# Altium project SX1255_HAT.PrjPcb
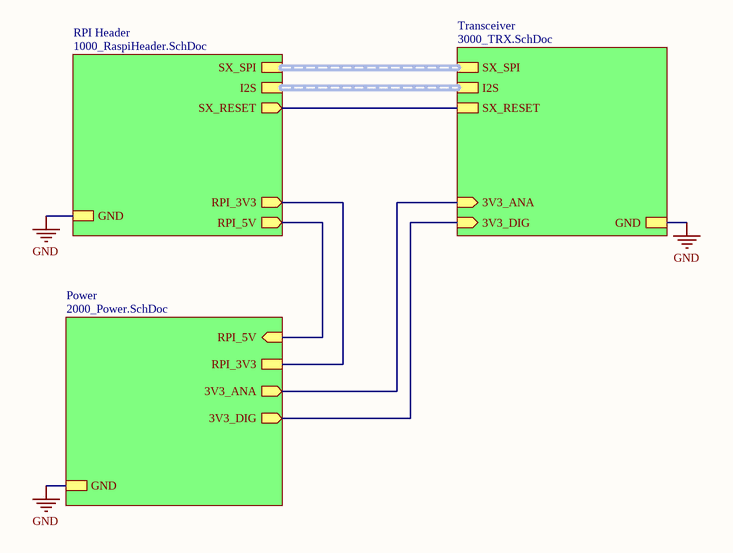
[diagram p0: TopSheet.SchDoc]
4 sheets, 7 parts. Net scope: hierarchical (ports join the sheet entries above them; power ports are global).
Board file: SX1255_HAT.PcbDoc
Sheets:
  TopSheet.SchDoc
    RPI Header = 1000_RaspiHeader.SchDoc
    Transceiver = 3000_TRX.SchDoc
    Power = 2000_Power.SchDoc

## Sheet TopSheet.SchDoc
size A4; SheetNumber: 1; SheetTotal: 4

### Sub-sheets
Power = 2000_Power.SchDoc: RPI_3V3, RPI_5V (in), 3V3_ANA (out), 3V3_DIG (out), GND
RPI Header = 1000_RaspiHeader.SchDoc: RPI_3V3 (out), RPI_5V (out), GND, SX_SPI, I2S, SX_RESET (out)
Transceiver = 3000_TRX.SchDoc: 3V3_ANA (in), 3V3_DIG (in), GND, SX_SPI, I2S, SX_RESET

### Nets
GND: sheet RPI Header/GND, sheet Transceiver/GND, sheet Power/GND
(unnamed): sheet RPI Header/RPI_3V3, sheet Power/RPI_3V3
(unnamed): sheet RPI Header/RPI_5V, sheet Power/RPI_5V
(unnamed): sheet RPI Header/SX_RESET, sheet Transceiver/SX_RESET
(unnamed): sheet Transceiver/3V3_ANA, sheet Power/3V3_ANA
(unnamed): sheet Transceiver/3V3_DIG, sheet Power/3V3_DIG

### Buses and harness runs
harness sheet RPI Header/I2S = sheet Transceiver/I2S
harness sheet RPI Header/SX_SPI = sheet Transceiver/SX_SPI

## Sheet 1000_RaspiHeader.SchDoc
size A3; SheetNumber: 2; SheetTotal: 4
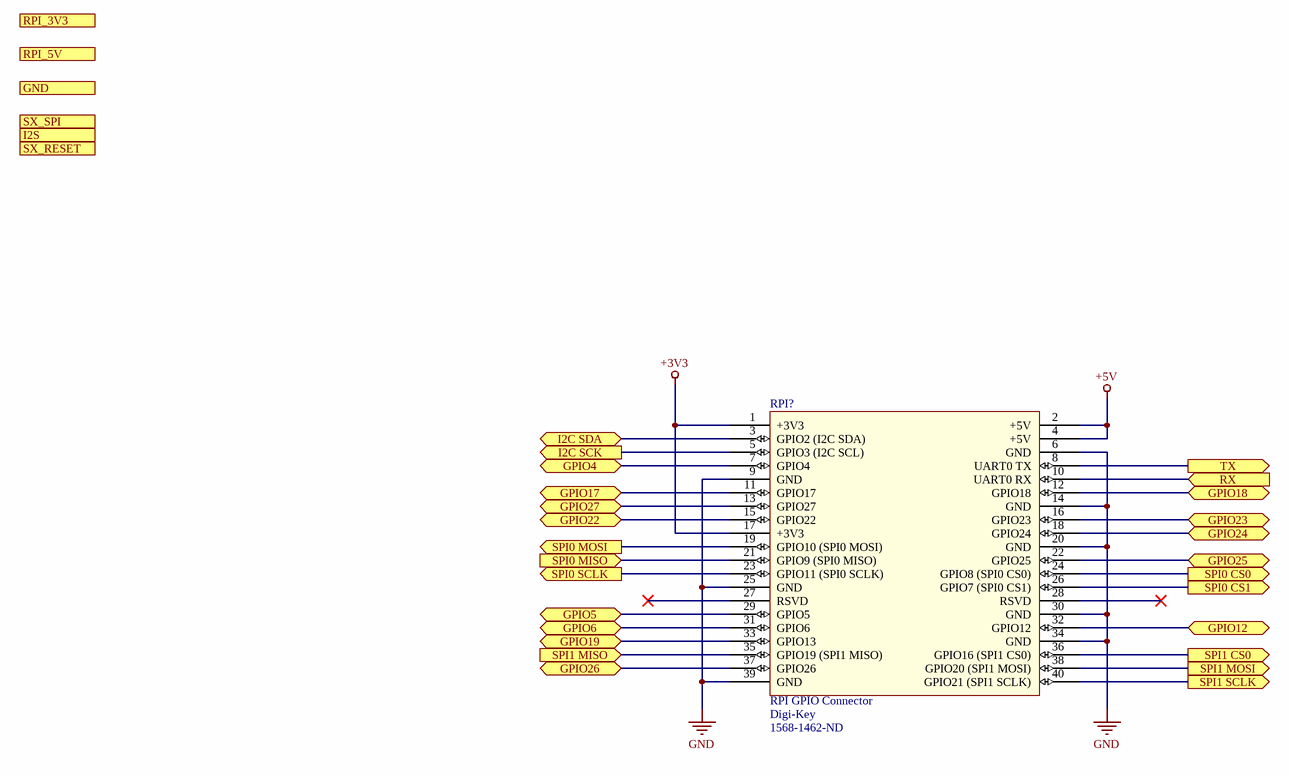
[diagram p1: 1000_RaspiHeader.SchDoc]

### Parts
RPI?  RPI GPIO Connector  Supplier 1: Digi-Key  Supplier Part Number 1: 1568-1462-ND  [rpi]

### Ports
GND, GPIO4 (bidir), GPIO5 (bidir), GPIO6 (bidir), GPIO12 (bidir), GPIO17 (bidir), GPIO18 (bidir), GPIO19 (bidir), GPIO22 (bidir), GPIO23 (bidir), GPIO24 (bidir), GPIO25 (bidir), GPIO26 (bidir), GPIO27 (bidir), I2C SCK (out), I2C SDA (bidir), I2S, RPI_3V3 (out), RPI_5V (out), RX (in), SPI0 CS0 (out), SPI0 CS1 (out), SPI0 MISO (in), SPI0 MOSI (out), SPI0 SCLK (out), SPI1 CS0 (out), SPI1 MISO (in), SPI1 MOSI (out), SPI1 SCLK (out), SX_RESET (out), SX_SPI, TX (out)

### Nets
+3V3: RPI?.1(+3V3) RPI?.17(+3V3)
+5V: RPI?.2(+5V) RPI?.4(+5V)
GND: RPI?.6(GND) RPI?.9(GND) RPI?.14(GND) RPI?.20(GND) RPI?.25(GND) RPI?.30(GND) RPI?.34(GND) RPI?.39(GND) ; port GND
NetRPI?_3: RPI?.3(GPIO2_(I2C_SDA)) ; port I2C SDA
NetRPI?_5: RPI?.5(GPIO3_(I2C_SCL)) ; port I2C SCK
NetRPI?_7: RPI?.7(GPIO4) ; port GPIO4
NetRPI?_8: RPI?.8(UART0_TX) ; port TX
NetRPI?_10: RPI?.10(UART0_RX) ; port RX
NetRPI?_11: RPI?.11(GPIO17) ; port GPIO17
NetRPI?_12: RPI?.12(GPIO18) ; port GPIO18
NetRPI?_13: RPI?.13(GPIO27) ; port GPIO27
NetRPI?_15: RPI?.15(GPIO22) ; port GPIO22
NetRPI?_16: RPI?.16(GPIO23) ; port GPIO23
NetRPI?_18: RPI?.18(GPIO24) ; port GPIO24
NetRPI?_19: RPI?.19(GPIO10_(SPI0_MOSI)) ; port SPI0 MOSI
NetRPI?_21: RPI?.21(GPIO9_(SPI0_MISO)) ; port SPI0 MISO
NetRPI?_22: RPI?.22(GPIO25) ; port GPIO25
NetRPI?_23: RPI?.23(GPIO11_(SPI0_SCLK)) ; port SPI0 SCLK
NetRPI?_24: RPI?.24(GPIO8_(SPI0_CS0)) ; port SPI0 CS0
NetRPI?_26: RPI?.26(GPIO7_(SPI0_CS1)) ; port SPI0 CS1
NetRPI?_29: RPI?.29(GPIO5) ; port GPIO5
NetRPI?_31: RPI?.31(GPIO6) ; port GPIO6
NetRPI?_32: RPI?.32(GPIO12) ; port GPIO12
NetRPI?_33: RPI?.33(GPIO13) ; port GPIO19
NetRPI?_35: RPI?.35(GPIO19_(SPI1_MISO)) ; port SPI1 MISO
NetRPI?_36: RPI?.36(GPIO16_(SPI1_CS0)) ; port SPI1 CS0
NetRPI?_37: RPI?.37(GPIO26) ; port GPIO26
NetRPI?_38: RPI?.38(GPIO20_(SPI1_MOSI)) ; port SPI1 MOSI
NetRPI?_40: RPI?.40(GPIO21_(SPI1_SCLK)) ; port SPI1 SCLK

Not connected (* = marked no-connect by the designer): RPI? 27(RSVD)* 28(RSVD)*

### Library data of the parts
RPI? = rpi connector: GPIO Header for Raspberry Pi A+/B+/Pi 2/Pi 3 - 2x20; Manufacturer: SparkFun Electronics; Manufacturer Part Number: PRT-14017; Nils Minor: author; nilsminor@web.de: mail; RoHS: RoHS Compliant; Category: Development Boards, Kits, Programmers; Stock 1: 150; Pricing 1: 1=1.84 (EUR); Part Status: Active; Accessory Type: Connector; For Use With/Related Products: Raspberry Pi; ComponentLink1URL: https://cdn.sparkfun.com/datasheets/Dev/RaspberryPi/12313.pdf; ComponentLink1Description: https://cdn.sparkfun.com/datasheets/Dev/RaspberryPi/12313.pdf

## Sheet 3000_TRX.SchDoc
size A3; SheetNumber: 4; SheetTotal: 4
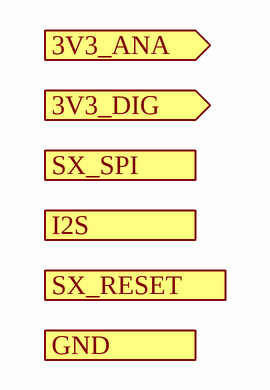
[diagram p2: 3000_TRX.SchDoc]

### Ports
3V3_ANA (in), 3V3_DIG (in), GND, I2S, SX_RESET, SX_SPI

## Sheet 2000_Power.SchDoc
size A3; SheetNumber: 3; SheetTotal: 4
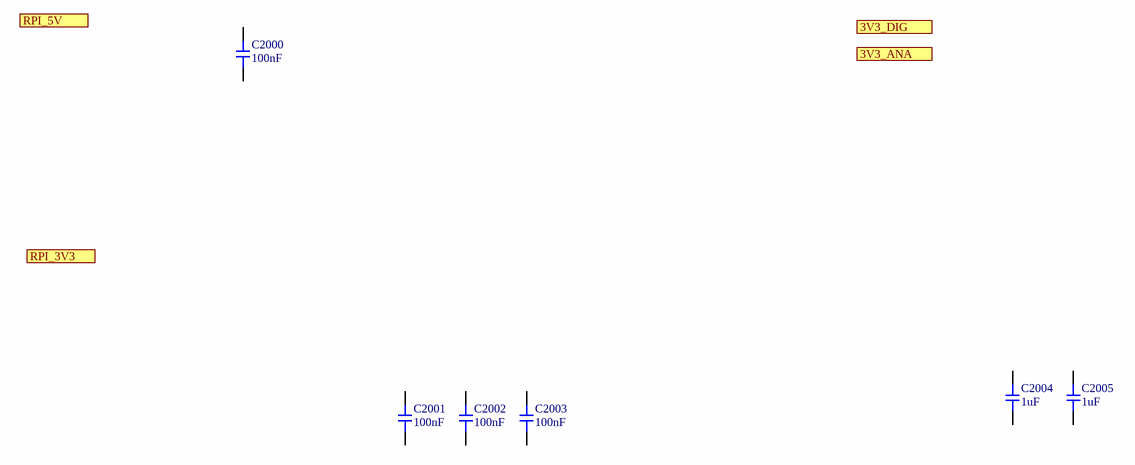
[diagram p3: 2000_Power.SchDoc]

### Parts
C2000  Capacitance: 100nF  [CAP-0603]  (hidden comment: CC0603KRX7R9BB104)
C2001  Capacitance: 100nF  [CAP-0603]  (hidden comment: CC0603KRX7R9BB104)
C2002  Capacitance: 100nF  [CAP-0603]  (hidden comment: CC0603KRX7R9BB104)
C2003  Capacitance: 100nF  [CAP-0603]  (hidden comment: CC0603KRX7R9BB104)
C2004  Capacitance: 1uF  [CAP-0603]  (hidden comment: CL10A105KB8NNNC)
C2005  Capacitance: 1uF  [CAP-0603]  (hidden comment: CL10A105KB8NNNC)

### Ports
3V3_ANA, 3V3_DIG, RPI_3V3, RPI_5V

### Nets

Not connected (* = marked no-connect by the designer): C2000 1 2; C2001 1 2; C2002 1 2; C2003 1 2; C2004 1 2; C2005 1 2

### Library data of the parts
C2000-C2003 = CC0603KRX7R9BB104: Capacitor, Ceramic (MLCC), 100nF, ±10%, 50V, X7R, ±10%, SMD 0603; Manufacturer: YAGEO; Package Size: 0603; JLCPCB Basic Part: Yes; JLCPCB Part Number: C14663; Supplier 1: LCSC; Category: Capacitors - MLCC; Supplier Part Number 1: C14663; Manufacturer Part Number: CC0603KRX7R9BB104; Tolerance: ±10%; Voltage Rating: 50V; Temperature Coefficient: X7R; RoHS: Yes; ComponentLink1Description: Datasheet; ComponentLink1URL: https://datasheet.lcsc.com/lcsc/1809301912_YAGEO-CC0603KRX7R9BB104_C14663.pdf; ComponentLink2Description: JLCPCB Part URL; ComponentLink2URL: https://jlcpcb.com/partdetail/C14663; ComponentLink3Description: LCSC Part URL; ComponentLink3URL: https://lcsc.com/product-detail/Multilayer-Ceramic-Capacitors-MLCC---SMD-SMT_YAGEO-YAGEO-CC0603KRX7R9BB104_C14663.html
C2004 C2005 = CL10A105KB8NNNC: Capacitor, Ceramic (MLCC), 1uF, ±10%, 50V, X5R, ±10%, SMD 0603; Manufacturer: Samsung Electro-Mechanics; Package Size: 0603; JLCPCB Basic Part: Yes; JLCPCB Part Number: C15849; Supplier 1: LCSC; Category: Capacitors - MLCC; Supplier Part Number 1: C15849; Manufacturer Part Number: CL10A105KB8NNNC; Tolerance: ±10%; Voltage Rating: 50V; Temperature Coefficient: X5R; RoHS: Yes; ComponentLink1Description: Datasheet; ComponentLink1URL: https://datasheet.lcsc.com/lcsc/1810261812_Samsung-Electro-Mechanics-CL10A105KB8NNNC_C15849.pdf; ComponentLink2Description: JLCPCB Part URL; ComponentLink2URL: https://jlcpcb.com/partdetail/C15849; ComponentLink3Description: LCSC Part URL; ComponentLink3URL: https://lcsc.com/product-detail/Multilayer-Ceramic-Capacitors-MLCC---SMD-SMT_Samsung-Electro-Mechanics-Samsung-Electro-Mechanics-CL10A105KB8NNNC_C15849.html